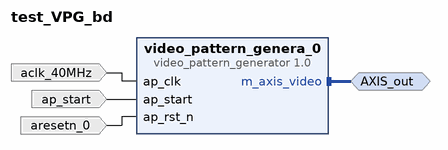
[diagram p0: block diagram of the top level]
# Vivado block design test_VPG_bd, xc7z020clg484-1, Vivado 2019.1
create_bd_design test_VPG_bd

create_bd_intf_port -mode Master -vlnv xilinx.com:interface:axis_rtl:1.0 AXIS_out
set_property -dict {CONFIG.FREQ_HZ 40000000} [get_bd_intf_ports AXIS_out]
create_bd_port -dir I -type clk aclk_40MHz
set_property -dict [list \
  CONFIG.ASSOCIATED_BUSIF AXIS_out \
  CONFIG.ASSOCIATED_RESET aresetn_0 \
  CONFIG.FREQ_HZ 40000000 \
] [get_bd_ports aclk_40MHz]
create_bd_port -dir I ap_start
create_bd_port -dir I -type rst aresetn_0

create_bd_cell -type ip -vlnv xilinx.com:hls:video_pattern_generator:1.0 video_pattern_genera_0

# ---- connections ----

connect_bd_intf_net [get_bd_intf_ports AXIS_out] [get_bd_intf_pins video_pattern_genera_0/m_axis_video]
connect_bd_net [get_bd_ports aclk_40MHz] [get_bd_pins video_pattern_genera_0/ap_clk]
connect_bd_net -net ap_start_0_1 [get_bd_ports ap_start] [get_bd_pins video_pattern_genera_0/ap_start]
connect_bd_net -net aresetn_0_1 [get_bd_ports aresetn_0] [get_bd_pins video_pattern_genera_0/ap_rst_n]

validate_bd_design
save_bd_design
